# Altium schematic sheet MB1246.SchDoc: MB1246
size A3; DocumentNumber: MB1246; Revision: B.1; SheetNumber: 1; SheetTotal: 17; Project: STM32H7xxI-EVAL
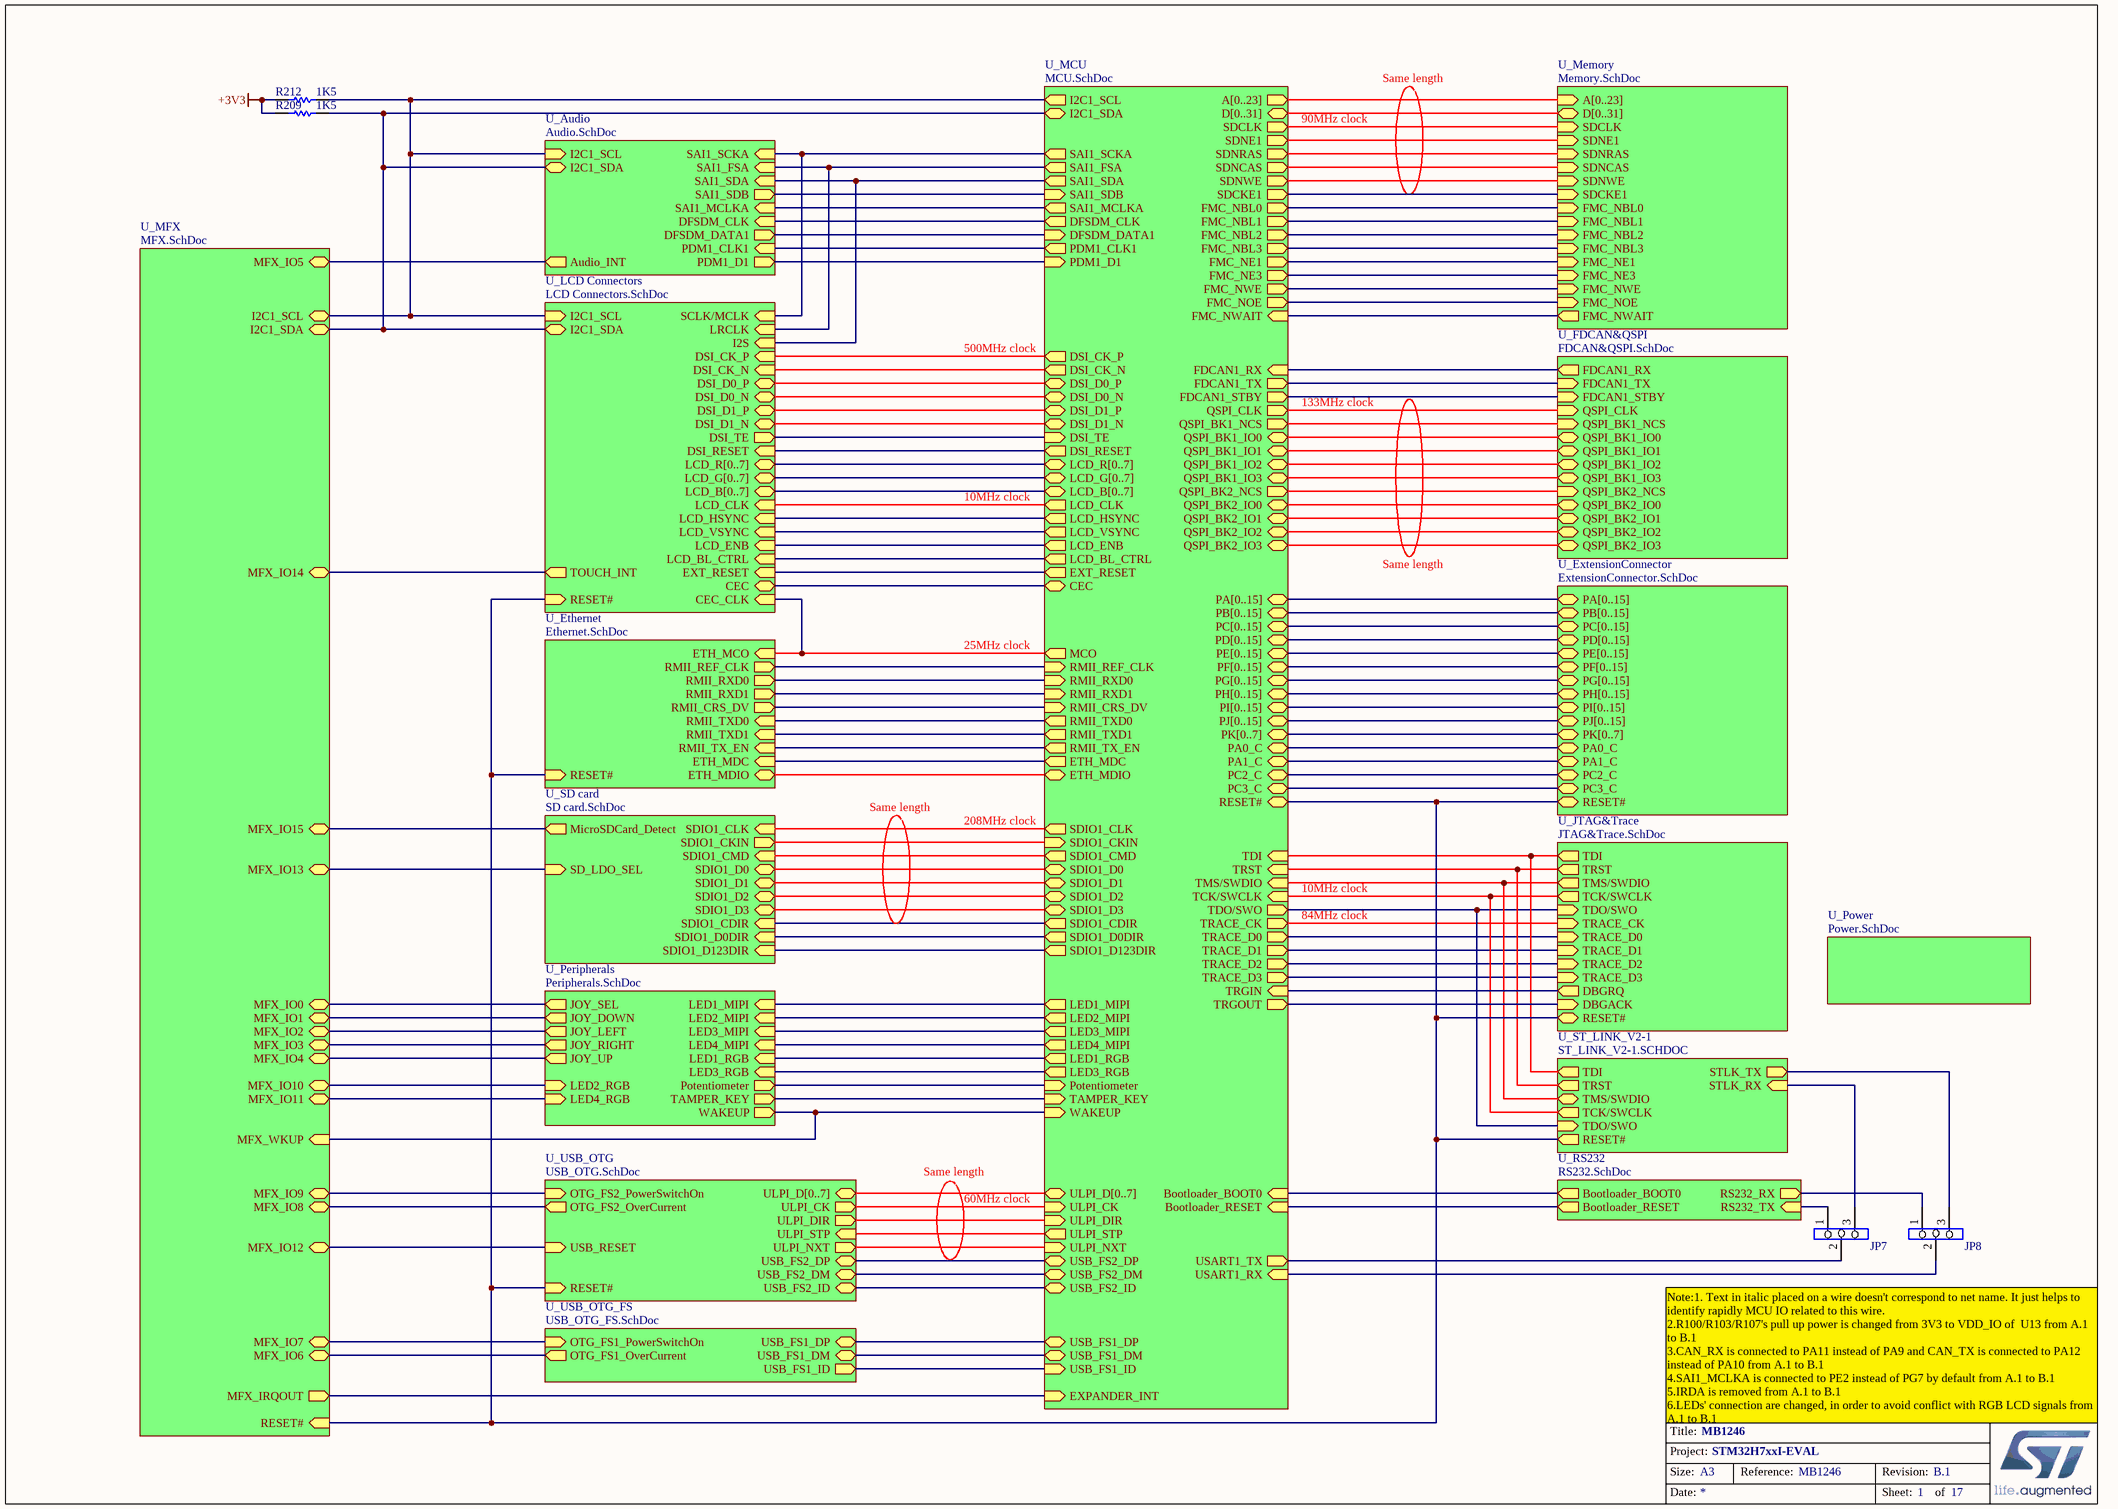
[diagram p0: MB1246.SchDoc]

## Parts
JP7  (no value)  [SIP3]
JP8  (no value)  [SIP3]
R209  1K5  [0603R]
R212  1K5  [0603R]

## Sub-sheets
U_Audio = Audio.SchDoc: SAI1_SCKA (in), SAI1_FSA (in), SAI1_SDA (in), SAI1_SDB (out), Audio_INT (out), I2C1_SDA (bidir), I2C1_SCL (in), SAI1_MCLKA (in), DFSDM_CLK (in), DFSDM_DATA1 (out), PDM1_CLK1 (in), PDM1_D1 (out)
U_Ethernet = Ethernet.SchDoc: ETH_MCO (in), RMII_TXD0 (in), RMII_TX_EN (in), RMII_RXD0 (out), RMII_REF_CLK (out), RMII_CRS_DV (out), ETH_MDC (in), ETH_MDIO (bidir), RMII_TXD1 (in), RMII_RXD1 (out), RESET# (in)
U_ExtensionConnector = ExtensionConnector.SchDoc: PA[0..15] (bidir), PB[0..15] (bidir), PC[0..15] (bidir), PD[0..15] (bidir), PE[0..15] (bidir), PF[0..15] (bidir), PG[0..15] (bidir), PH[0..15] (bidir), PI[0..15] (bidir), PJ[0..15] (bidir), PK[0..7] (bidir), RESET# (bidir), PA0_C (bidir), PA1_C (bidir), PC2_C (bidir), PC3_C (bidir)
U_FDCAN&QSPI = FDCAN&QSPI.SchDoc: FDCAN1_TX (in), FDCAN1_RX (out), FDCAN1_STBY (in), QSPI_BK1_IO3 (bidir), QSPI_BK1_IO1 (bidir), QSPI_BK1_NCS (in), QSPI_BK1_IO0 (bidir), QSPI_BK1_IO2 (bidir), QSPI_CLK (in), QSPI_BK2_NCS (in), QSPI_BK2_IO0 (bidir), QSPI_BK2_IO1 (bidir), QSPI_BK2_IO2 (bidir), QSPI_BK2_IO3 (bidir)
U_JTAG&Trace = JTAG&Trace.SchDoc: TDI (out), RESET# (bidir), TRACE_D3 (in), TRACE_D2 (in), TRACE_D1 (in), TRACE_D0 (in), TRACE_CK (in), TRST (out), TMS/SWDIO (out), TCK/SWCLK (out), TDO/SWO (in), DBGRQ (out), DBGACK (in)
U_LCD Connectors = LCD Connectors.SchDoc: LCD_R[0..7] (bidir), LCD_HSYNC (in), LCD_VSYNC (in), LCD_CLK (in), LCD_ENB (in), I2C1_SDA (bidir), I2C1_SCL (in), LCD_B[0..7] (bidir), LCD_G[0..7] (bidir), TOUCH_INT (out), EXT_RESET (in), DSI_CK_P (in), DSI_CK_N (in), DSI_D0_P (bidir), DSI_D0_N (bidir), DSI_D1_P (bidir), DSI_D1_N (bidir), LCD_BL_CTRL (in), DSI_TE (out), DSI_RESET (in), SCLK/MCLK (in), LRCLK (in), I2S (in), CEC (bidir), CEC_CLK (in), RESET# (in)
U_MCU = MCU.SchDoc: PA[0..15] (bidir), PB[0..15] (bidir), PC[0..15] (bidir), PD[0..15] (bidir), PE[0..15] (bidir), PF[0..15] (bidir), PG[0..15] (bidir), PH[0..15] (bidir), PI[0..15] (bidir), TMS/SWDIO (in), TCK/SWCLK (in), TDI (in), ULPI_STP (out), ETH_MDC (out), RMII_RXD0 (in), RMII_RXD1 (in), SDIO1_D0 (bidir), EXT_RESET (out), SDIO1_CLK (out), TAMPER_KEY (in), LCD_ENB (out), SDIO1_CMD (out), FMC_NOE (out), FMC_NWE (out), FMC_NWAIT (in), FMC_NE1 (out), FMC_NBL3 (out), FMC_NBL2 (out), EXPANDER_INT (in), ULPI_DIR (in), LCD_HSYNC (out), LCD_VSYNC (out), LCD_CLK (out), FMC_NBL0 (out), FMC_NBL1 (out), TRACE_CK (out), TRACE_D0 (out), TRACE_D2 (out), TRACE_D1 (out), SAI1_SDA (out), TRACE_D3 (out), SAI1_SDB (in), SAI1_SCKA (out), SAI1_FSA (out), SAI1_MCLKA (out), SDNRAS (out), SDCLK (out), FMC_NE3 (out), RMII_TX_EN (out), RMII_TXD1 (out), SDNCAS (out), SDCKE1 (out), SDNE1 (out), ULPI_NXT (in), SDNWE (out), LCD_G[0..7] (bidir), LCD_B[0..7] (bidir), D[0..31] (bidir), A[0..23] (out), ULPI_D[0..7] (bidir), PJ[0..15] (bidir), PK[0..7] (bidir), LCD_R[0..7] (bidir), QSPI_BK1_IO3 (bidir), QSPI_BK1_IO2 (bidir), QSPI_BK1_IO1 (bidir), QSPI_BK1_IO0 (bidir), DSI_TE (in), DSI_CK_P (out), DSI_CK_N (out), DSI_D0_P (bidir), DSI_D0_N (bidir), DSI_D1_P (bidir), DSI_D1_N (bidir), DSI_RESET (out), LED1_MIPI (out), LED2_MIPI (out), LED3_MIPI (out), LED4_MIPI (out), RMII_REF_CLK (in), ETH_MDIO (bidir), ULPI_CK (in), RMII_CRS_DV (in), LCD_BL_CTRL (out), USART1_TX (out), USART1_RX (in), USB_FS1_ID (in), FDCAN1_RX (in), USB_FS1_DM (bidir), FDCAN1_TX (out), USB_FS1_DP (bidir), MCO (out), WAKEUP (in), TDO/SWO (out), TRST (in), I2C1_SCL (out), I2C1_SDA (bidir), USB_FS2_ID (bidir), USB_FS2_DM (bidir), USB_FS2_DP (bidir), QSPI_BK1_NCS (out), RMII_TXD0 (out), QSPI_CLK (out), SDIO1_CKIN (in), SDIO1_CDIR (out), DFSDM_CLK (out), DFSDM_DATA1 (in), SDIO1_D0DIR (out), SDIO1_D123DIR (out), SDIO1_D1 (bidir), SDIO1_D2 (bidir), SDIO1_D3 (bidir), FDCAN1_STBY (out), PDM1_CLK1 (out), PDM1_D1 (in), QSPI_BK2_IO2 (bidir), QSPI_BK2_IO3 (bidir), QSPI_BK2_IO0 (bidir), QSPI_BK2_IO1 (bidir), RESET# (bidir), Bootloader_BOOT0 (in), Bootloader_RESET (in), PA0_C (bidir), PA1_C (bidir), PC2_C (bidir), PC3_C (bidir), QSPI_BK2_NCS (out), CEC (bidir), Potentiometer (in), TRGOUT (out), TRGIN (in), LED1_RGB (out), LED3_RGB (out)
U_Memory = Memory.SchDoc: FMC_NE1 (in), FMC_NWE (in), FMC_NOE (in), FMC_NWAIT (out), FMC_NBL0 (in), FMC_NBL1 (in), D[0..31] (bidir), A[0..23] (in), SDNCAS (in), SDNWE (in), SDNRAS (in), SDNE1 (in), SDCKE1 (in), SDCLK (in), FMC_NBL3 (in), FMC_NBL2 (in), FMC_NE3 (in)
U_MFX = MFX.SchDoc: MFX_IRQOUT (out), I2C1_SDA (bidir), I2C1_SCL (bidir), MFX_IO5 (bidir), MFX_IO6 (bidir), MFX_IO7 (bidir), MFX_IO8 (bidir), MFX_IO9 (bidir), MFX_IO10 (bidir), MFX_IO11 (bidir), MFX_IO12 (bidir), MFX_IO13 (bidir), MFX_IO14 (bidir), MFX_IO15 (bidir), MFX_WKUP (in), MFX_IO0 (bidir), MFX_IO1 (bidir), MFX_IO2 (bidir), MFX_IO3 (bidir), MFX_IO4 (bidir), RESET# (in)
U_Peripherals = Peripherals.SchDoc: JOY_SEL (out), JOY_DOWN (out), JOY_LEFT (out), JOY_RIGHT (out), JOY_UP (out), TAMPER_KEY (out), WAKEUP (out), Potentiometer (out), LED4_MIPI (in), LED3_MIPI (in), LED1_MIPI (in), LED2_MIPI (in), LED1_RGB (in), LED2_RGB (in), LED3_RGB (in), LED4_RGB (in)
U_Power = Power.SchDoc: no entries
U_RS232 = RS232.SchDoc: RS232_TX (in), RS232_RX (out), Bootloader_BOOT0 (out), Bootloader_RESET (out)
U_SD card = SD card.SchDoc: SDIO1_CKIN (out), SDIO1_CDIR (in), SDIO1_D0DIR (in), SDIO1_D123DIR (in), SDIO1_D0 (bidir), SDIO1_D1 (bidir), SDIO1_D2 (bidir), SDIO1_D3 (bidir), SDIO1_CMD (in), SDIO1_CLK (in), SD_LDO_SEL (in), MicroSDCard_Detect (out)
U_ST_LINK_V2-1 = ST_LINK_V2-1.SCHDOC: STLK_RX (in), STLK_TX (out), TDI (out), TRST (out), TMS/SWDIO (bidir), TCK/SWCLK (out), TDO/SWO (in), RESET# (out)
U_USB_OTG = USB_OTG.SchDoc: ULPI_D[0..7] (bidir), ULPI_CK (out), ULPI_DIR (out), ULPI_NXT (out), ULPI_STP (in), USB_RESET (in), USB_FS2_DM (bidir), USB_FS2_DP (bidir), OTG_FS2_PowerSwitchOn (in), OTG_FS2_OverCurrent (out), USB_FS2_ID (bidir), RESET# (in)
U_USB_OTG_FS = USB_OTG_FS.SchDoc: OTG_FS1_PowerSwitchOn (in), OTG_FS1_OverCurrent (out), USB_FS1_DM (bidir), USB_FS1_DP (bidir), USB_FS1_ID (out)

## Nets
+3V3: R209.1 R212.1
NetJP7_1: JP7.1 ; sheet U_RS232/RS232_TX
NetJP7_2: JP7.2 ; sheet U_MCU/USART1_TX
NetJP7_3: JP7.3 ; sheet U_ST_LINK_V2-1/STLK_RX
NetJP8_1: JP8.1 ; sheet U_RS232/RS232_RX
NetJP8_2: JP8.2 ; sheet U_MCU/USART1_RX
NetJP8_3: JP8.3 ; sheet U_ST_LINK_V2-1/STLK_TX
NetR209_2: R209.2 ; sheet U_Audio/I2C1_SDA, sheet U_MFX/I2C1_SDA, sheet U_MCU/I2C1_SDA, sheet U_LCD Connectors/I2C1_SDA
NetR212_2: R212.2 ; sheet U_Audio/I2C1_SCL, sheet U_MFX/I2C1_SCL, sheet U_MCU/I2C1_SCL, sheet U_LCD Connectors/I2C1_SCL
(unnamed): sheet U_Audio/SAI1_SCKA, sheet U_MCU/SAI1_SCKA, sheet U_LCD Connectors/SCLK/MCLK
(unnamed): sheet U_Audio/SAI1_FSA, sheet U_MCU/SAI1_FSA, sheet U_LCD Connectors/LRCLK
(unnamed): sheet U_Audio/SAI1_SDA, sheet U_MCU/SAI1_SDA, sheet U_LCD Connectors/I2S
(unnamed): sheet U_Audio/SAI1_SDB, sheet U_MCU/SAI1_SDB
(unnamed): sheet U_Audio/Audio_INT, sheet U_MFX/MFX_IO5
(unnamed): sheet U_Audio/SAI1_MCLKA, sheet U_MCU/SAI1_MCLKA
(unnamed): sheet U_Audio/DFSDM_CLK, sheet U_MCU/DFSDM_CLK
(unnamed): sheet U_Audio/DFSDM_DATA1, sheet U_MCU/DFSDM_DATA1
(unnamed): sheet U_Audio/PDM1_CLK1, sheet U_MCU/PDM1_CLK1
(unnamed): sheet U_Audio/PDM1_D1, sheet U_MCU/PDM1_D1
(unnamed): sheet U_ExtensionConnector/RESET#, sheet U_MFX/RESET#, sheet U_ST_LINK_V2-1/RESET#, sheet U_JTAG&Trace/RESET#, sheet U_Ethernet/RESET#, sheet U_MCU/RESET#, sheet U_USB_OTG/RESET#, sheet U_LCD Connectors/RESET#
(unnamed): sheet U_ExtensionConnector/PA0_C, sheet U_MCU/PA0_C
(unnamed): sheet U_ExtensionConnector/PA1_C, sheet U_MCU/PA1_C
(unnamed): sheet U_ExtensionConnector/PC2_C, sheet U_MCU/PC2_C
(unnamed): sheet U_ExtensionConnector/PC3_C, sheet U_MCU/PC3_C
(unnamed): sheet U_FDCAN&QSPI/FDCAN1_TX, sheet U_MCU/FDCAN1_TX
(unnamed): sheet U_FDCAN&QSPI/FDCAN1_RX, sheet U_MCU/FDCAN1_RX
(unnamed): sheet U_FDCAN&QSPI/FDCAN1_STBY, sheet U_MCU/FDCAN1_STBY
(unnamed): sheet U_FDCAN&QSPI/QSPI_BK1_IO3, sheet U_MCU/QSPI_BK1_IO3
(unnamed): sheet U_FDCAN&QSPI/QSPI_BK1_IO1, sheet U_MCU/QSPI_BK1_IO1
(unnamed): sheet U_FDCAN&QSPI/QSPI_BK1_NCS, sheet U_MCU/QSPI_BK1_NCS
(unnamed): sheet U_FDCAN&QSPI/QSPI_BK1_IO0, sheet U_MCU/QSPI_BK1_IO0
(unnamed): sheet U_FDCAN&QSPI/QSPI_BK1_IO2, sheet U_MCU/QSPI_BK1_IO2
(unnamed): sheet U_FDCAN&QSPI/QSPI_CLK, sheet U_MCU/QSPI_CLK
(unnamed): sheet U_FDCAN&QSPI/QSPI_BK2_NCS, sheet U_MCU/QSPI_BK2_NCS
(unnamed): sheet U_FDCAN&QSPI/QSPI_BK2_IO0, sheet U_MCU/QSPI_BK2_IO0
(unnamed): sheet U_FDCAN&QSPI/QSPI_BK2_IO1, sheet U_MCU/QSPI_BK2_IO1
(unnamed): sheet U_FDCAN&QSPI/QSPI_BK2_IO2, sheet U_MCU/QSPI_BK2_IO2
(unnamed): sheet U_FDCAN&QSPI/QSPI_BK2_IO3, sheet U_MCU/QSPI_BK2_IO3
(unnamed): sheet U_Memory/FMC_NE1, sheet U_MCU/FMC_NE1
(unnamed): sheet U_Memory/FMC_NWE, sheet U_MCU/FMC_NWE
(unnamed): sheet U_Memory/FMC_NOE, sheet U_MCU/FMC_NOE
(unnamed): sheet U_Memory/FMC_NWAIT, sheet U_MCU/FMC_NWAIT
(unnamed): sheet U_Memory/FMC_NBL0, sheet U_MCU/FMC_NBL0
(unnamed): sheet U_Memory/FMC_NBL1, sheet U_MCU/FMC_NBL1
(unnamed): sheet U_Memory/SDNCAS, sheet U_MCU/SDNCAS
(unnamed): sheet U_Memory/SDNWE, sheet U_MCU/SDNWE
(unnamed): sheet U_Memory/SDNRAS, sheet U_MCU/SDNRAS
(unnamed): sheet U_Memory/SDNE1, sheet U_MCU/SDNE1
(unnamed): sheet U_Memory/SDCKE1, sheet U_MCU/SDCKE1
(unnamed): sheet U_Memory/SDCLK, sheet U_MCU/SDCLK
(unnamed): sheet U_Memory/FMC_NBL3, sheet U_MCU/FMC_NBL3
(unnamed): sheet U_Memory/FMC_NBL2, sheet U_MCU/FMC_NBL2
(unnamed): sheet U_Memory/FMC_NE3, sheet U_MCU/FMC_NE3
(unnamed): sheet U_MFX/MFX_IRQOUT, sheet U_MCU/EXPANDER_INT
(unnamed): sheet U_MFX/MFX_IO6, sheet U_USB_OTG_FS/OTG_FS1_OverCurrent
(unnamed): sheet U_MFX/MFX_IO7, sheet U_USB_OTG_FS/OTG_FS1_PowerSwitchOn
(unnamed): sheet U_MFX/MFX_IO8, sheet U_USB_OTG/OTG_FS2_OverCurrent
(unnamed): sheet U_MFX/MFX_IO9, sheet U_USB_OTG/OTG_FS2_PowerSwitchOn
(unnamed): sheet U_MFX/MFX_IO10, sheet U_Peripherals/LED2_RGB
(unnamed): sheet U_MFX/MFX_IO11, sheet U_Peripherals/LED4_RGB
(unnamed): sheet U_MFX/MFX_IO12, sheet U_USB_OTG/USB_RESET
(unnamed): sheet U_MFX/MFX_IO13, sheet U_SD card/SD_LDO_SEL
(unnamed): sheet U_MFX/MFX_IO14, sheet U_LCD Connectors/TOUCH_INT
(unnamed): sheet U_MFX/MFX_IO15, sheet U_SD card/MicroSDCard_Detect
(unnamed): sheet U_MFX/MFX_WKUP, sheet U_Peripherals/WAKEUP, sheet U_MCU/WAKEUP
(unnamed): sheet U_MFX/MFX_IO0, sheet U_Peripherals/JOY_SEL
(unnamed): sheet U_MFX/MFX_IO1, sheet U_Peripherals/JOY_DOWN
(unnamed): sheet U_MFX/MFX_IO2, sheet U_Peripherals/JOY_LEFT
(unnamed): sheet U_MFX/MFX_IO3, sheet U_Peripherals/JOY_RIGHT
(unnamed): sheet U_MFX/MFX_IO4, sheet U_Peripherals/JOY_UP
(unnamed): sheet U_ST_LINK_V2-1/TDI, sheet U_JTAG&Trace/TDI, sheet U_MCU/TDI
(unnamed): sheet U_ST_LINK_V2-1/TRST, sheet U_JTAG&Trace/TRST, sheet U_MCU/TRST
(unnamed): sheet U_ST_LINK_V2-1/TMS/SWDIO, sheet U_JTAG&Trace/TMS/SWDIO, sheet U_MCU/TMS/SWDIO
(unnamed): sheet U_ST_LINK_V2-1/TCK/SWCLK, sheet U_JTAG&Trace/TCK/SWCLK, sheet U_MCU/TCK/SWCLK
(unnamed): sheet U_ST_LINK_V2-1/TDO/SWO, sheet U_JTAG&Trace/TDO/SWO, sheet U_MCU/TDO/SWO
(unnamed): sheet U_USB_OTG_FS/USB_FS1_DM, sheet U_MCU/USB_FS1_DM
(unnamed): sheet U_USB_OTG_FS/USB_FS1_DP, sheet U_MCU/USB_FS1_DP
(unnamed): sheet U_USB_OTG_FS/USB_FS1_ID, sheet U_MCU/USB_FS1_ID
(unnamed): sheet U_SD card/SDIO1_CKIN, sheet U_MCU/SDIO1_CKIN
(unnamed): sheet U_SD card/SDIO1_CDIR, sheet U_MCU/SDIO1_CDIR
(unnamed): sheet U_SD card/SDIO1_D0DIR, sheet U_MCU/SDIO1_D0DIR
(unnamed): sheet U_SD card/SDIO1_D123DIR, sheet U_MCU/SDIO1_D123DIR
(unnamed): sheet U_SD card/SDIO1_D0, sheet U_MCU/SDIO1_D0
(unnamed): sheet U_SD card/SDIO1_D1, sheet U_MCU/SDIO1_D1
(unnamed): sheet U_SD card/SDIO1_D2, sheet U_MCU/SDIO1_D2
(unnamed): sheet U_SD card/SDIO1_D3, sheet U_MCU/SDIO1_D3
(unnamed): sheet U_SD card/SDIO1_CMD, sheet U_MCU/SDIO1_CMD
(unnamed): sheet U_SD card/SDIO1_CLK, sheet U_MCU/SDIO1_CLK
(unnamed): sheet U_JTAG&Trace/TRACE_D3, sheet U_MCU/TRACE_D3
(unnamed): sheet U_JTAG&Trace/TRACE_D2, sheet U_MCU/TRACE_D2
(unnamed): sheet U_JTAG&Trace/TRACE_D1, sheet U_MCU/TRACE_D1
(unnamed): sheet U_JTAG&Trace/TRACE_D0, sheet U_MCU/TRACE_D0
(unnamed): sheet U_JTAG&Trace/TRACE_CK, sheet U_MCU/TRACE_CK
(unnamed): sheet U_JTAG&Trace/DBGRQ, sheet U_MCU/TRGIN
(unnamed): sheet U_JTAG&Trace/DBGACK, sheet U_MCU/TRGOUT
(unnamed): sheet U_Ethernet/ETH_MCO, sheet U_MCU/MCO, sheet U_LCD Connectors/CEC_CLK
(unnamed): sheet U_Ethernet/RMII_TXD0, sheet U_MCU/RMII_TXD0
(unnamed): sheet U_Ethernet/RMII_TX_EN, sheet U_MCU/RMII_TX_EN
(unnamed): sheet U_Ethernet/RMII_RXD0, sheet U_MCU/RMII_RXD0
(unnamed): sheet U_Ethernet/RMII_REF_CLK, sheet U_MCU/RMII_REF_CLK
(unnamed): sheet U_Ethernet/RMII_CRS_DV, sheet U_MCU/RMII_CRS_DV
(unnamed): sheet U_Ethernet/ETH_MDC, sheet U_MCU/ETH_MDC
(unnamed): sheet U_Ethernet/ETH_MDIO, sheet U_MCU/ETH_MDIO
(unnamed): sheet U_Ethernet/RMII_TXD1, sheet U_MCU/RMII_TXD1
(unnamed): sheet U_Ethernet/RMII_RXD1, sheet U_MCU/RMII_RXD1
(unnamed): sheet U_RS232/Bootloader_BOOT0, sheet U_MCU/Bootloader_BOOT0
(unnamed): sheet U_RS232/Bootloader_RESET, sheet U_MCU/Bootloader_RESET
(unnamed): sheet U_Peripherals/TAMPER_KEY, sheet U_MCU/TAMPER_KEY
(unnamed): sheet U_Peripherals/Potentiometer, sheet U_MCU/Potentiometer
(unnamed): sheet U_Peripherals/LED4_MIPI, sheet U_MCU/LED4_MIPI
(unnamed): sheet U_Peripherals/LED3_MIPI, sheet U_MCU/LED3_MIPI
(unnamed): sheet U_Peripherals/LED1_MIPI, sheet U_MCU/LED1_MIPI
(unnamed): sheet U_Peripherals/LED2_MIPI, sheet U_MCU/LED2_MIPI
(unnamed): sheet U_Peripherals/LED1_RGB, sheet U_MCU/LED1_RGB
(unnamed): sheet U_Peripherals/LED3_RGB, sheet U_MCU/LED3_RGB
(unnamed): sheet U_MCU/ULPI_STP, sheet U_USB_OTG/ULPI_STP
(unnamed): sheet U_MCU/EXT_RESET, sheet U_LCD Connectors/EXT_RESET
(unnamed): sheet U_MCU/LCD_ENB, sheet U_LCD Connectors/LCD_ENB
(unnamed): sheet U_MCU/ULPI_DIR, sheet U_USB_OTG/ULPI_DIR
(unnamed): sheet U_MCU/LCD_HSYNC, sheet U_LCD Connectors/LCD_HSYNC
(unnamed): sheet U_MCU/LCD_VSYNC, sheet U_LCD Connectors/LCD_VSYNC
(unnamed): sheet U_MCU/LCD_CLK, sheet U_LCD Connectors/LCD_CLK
(unnamed): sheet U_MCU/ULPI_NXT, sheet U_USB_OTG/ULPI_NXT
(unnamed): sheet U_MCU/DSI_TE, sheet U_LCD Connectors/DSI_TE
(unnamed): sheet U_MCU/DSI_CK_P, sheet U_LCD Connectors/DSI_CK_P
(unnamed): sheet U_MCU/DSI_CK_N, sheet U_LCD Connectors/DSI_CK_N
(unnamed): sheet U_MCU/DSI_D0_P, sheet U_LCD Connectors/DSI_D0_P
(unnamed): sheet U_MCU/DSI_D0_N, sheet U_LCD Connectors/DSI_D0_N
(unnamed): sheet U_MCU/DSI_D1_P, sheet U_LCD Connectors/DSI_D1_P
(unnamed): sheet U_MCU/DSI_D1_N, sheet U_LCD Connectors/DSI_D1_N
(unnamed): sheet U_MCU/DSI_RESET, sheet U_LCD Connectors/DSI_RESET
(unnamed): sheet U_MCU/ULPI_CK, sheet U_USB_OTG/ULPI_CK
(unnamed): sheet U_MCU/LCD_BL_CTRL, sheet U_LCD Connectors/LCD_BL_CTRL
(unnamed): sheet U_MCU/USB_FS2_ID, sheet U_USB_OTG/USB_FS2_ID
(unnamed): sheet U_MCU/USB_FS2_DM, sheet U_USB_OTG/USB_FS2_DM
(unnamed): sheet U_MCU/USB_FS2_DP, sheet U_USB_OTG/USB_FS2_DP
(unnamed): sheet U_MCU/CEC, sheet U_LCD Connectors/CEC

## Buses and harness runs
bus sheet U_ExtensionConnector/PA[0..15] = sheet U_MCU/PA[0..15]
bus sheet U_ExtensionConnector/PB[0..15] = sheet U_MCU/PB[0..15]
bus sheet U_ExtensionConnector/PC[0..15] = sheet U_MCU/PC[0..15]
bus sheet U_ExtensionConnector/PD[0..15] = sheet U_MCU/PD[0..15]
bus sheet U_ExtensionConnector/PE[0..15] = sheet U_MCU/PE[0..15]
bus sheet U_ExtensionConnector/PF[0..15] = sheet U_MCU/PF[0..15]
bus sheet U_ExtensionConnector/PG[0..15] = sheet U_MCU/PG[0..15]
bus sheet U_ExtensionConnector/PH[0..15] = sheet U_MCU/PH[0..15]
bus sheet U_ExtensionConnector/PI[0..15] = sheet U_MCU/PI[0..15]
bus sheet U_ExtensionConnector/PJ[0..15] = sheet U_MCU/PJ[0..15]
bus sheet U_ExtensionConnector/PK[0..7] = sheet U_MCU/PK[0..7]
bus sheet U_LCD Connectors/LCD_B[0..7] = sheet U_MCU/LCD_B[0..7]
bus sheet U_LCD Connectors/LCD_G[0..7] = sheet U_MCU/LCD_G[0..7]
bus sheet U_LCD Connectors/LCD_R[0..7] = sheet U_MCU/LCD_R[0..7]
bus sheet U_MCU/A[0..23] = sheet U_Memory/A[0..23]
bus sheet U_MCU/D[0..31] = sheet U_Memory/D[0..31]
bus sheet U_MCU/ULPI_D[0..7] = sheet U_USB_OTG/ULPI_D[0..7]

## Notes on the sheet
- Same length
- 90MHz clock
- 500MHz clock
- 133MHz clock
- 10MHz clock
- 25MHz clock
- 208MHz clock
- 84MHz clock
- 60MHz clock
- Note:1. Text in italic placed on a wire doesn't correspond to net name. It just helps to identify rapidly MCU IO related to this wire.
  2.R100/R103/R107's pull up power is changed from 3V3 to VDD_IO of  U13 from A.1 to B.1
  3.CAN_RX is connected to PA11 instead of PA9 and CAN_TX is connected to PA12 instead of PA10 from A.1 to B.1
  4.SAI1_MCLKA is connected to PE2 instead of PG7 by default from A.1 to B.1
  5.IRDA is removed from A.1 to B.1
  6.LEDs' connection are changed, in order to avoid conflict with RGB LCD signals from A.1 to B.1
- Title:
- Project:
- Size:
- Date:
- A3
- Reference:
- Sheet:
- Revision:
- of

## Library data of the parts
JP7 JP8 = Jumper3
R209 R212 = Res1: Resistor; Value: 1K; Published: 8-Jun-2000; Revision: July-2002: Re-released for DXP Platform.; Publisher: Altium Limited